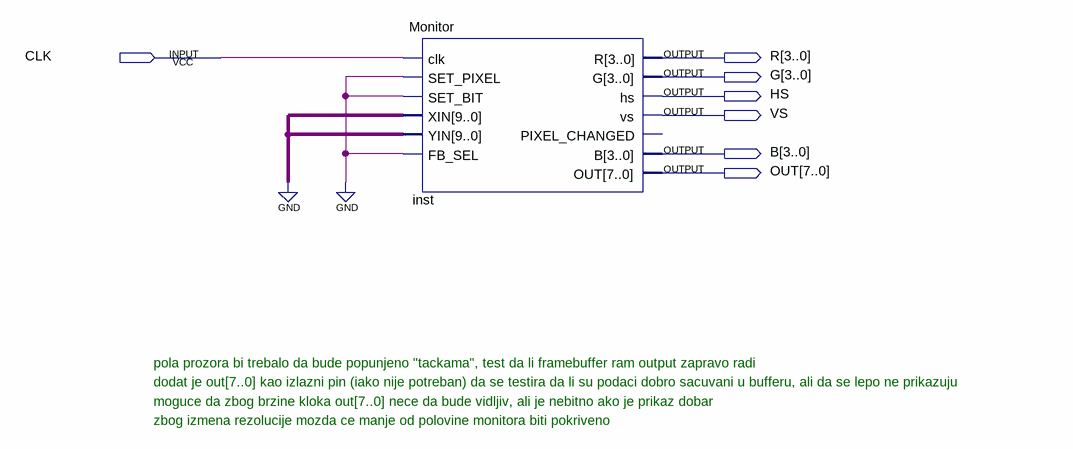
[diagram p0: schematic sheet]
// Quartus schematic VgaTest2_1.bdf as structural Verilog: 1 symbols, 7 pins
module VgaTest2_1 (
  input  CLK,
  output [3:0] R,
  output [3:0] G,
  output HS,
  output VS,
  output [3:0] B,
  output [7:0] OUT
);

  Monitor inst (
    .clk(CLK), .SET_PIXEL(1'b0), .SET_BIT(1'b0), .XIN({10{1'b0}}), .YIN({10{1'b0}}), .FB_SEL(1'b0), .R(R),
    .G(G), .hs(HS), .vs(VS), .B(B), .OUT(OUT));  // open: PIXEL_CHANGED

  // Notes on the sheet:
  //   pola prozora bi trebalo da bude popunjeno "tackama", test da li framebuffer ram output zapravo radi
  //   dodat je out[7..0] kao izlazni pin (iako nije potreban) da se testira da li su podaci dobro sacuvani u bufferu, ali da se lepo ne prikazuju
  //   moguce da zbog brzine kloka out[7..0] nece da bude vidljiv, ali je nebitno ako je prikaz dobar
  //   zbog izmena rezolucije mozda ce manje od polovine monitora biti pokriveno
endmodule
